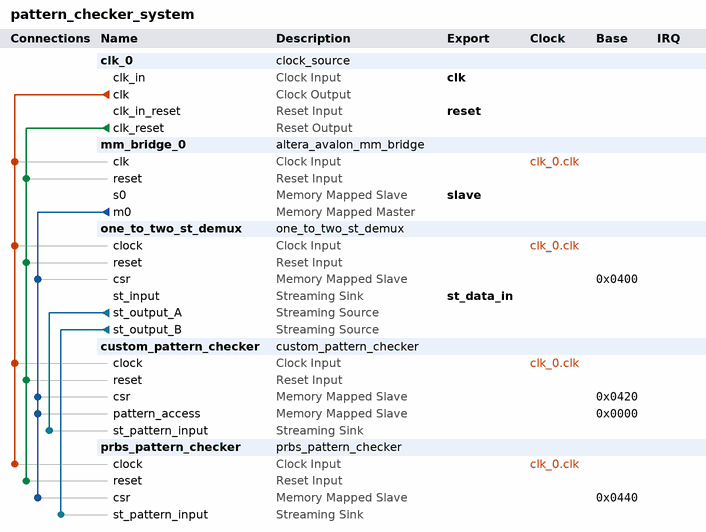
[diagram p0: system contents]
# Platform Designer (Qsys) system pattern_checker_system
# Parameters at their usual value, and those the tool derives, are not listed.
package require -exact qsys 11.0
create_system pattern_checker_system
set_project_property DEVICE_FAMILY CYCLONEIII

add_instance clk_0 clock_source 11.0
set_instance_parameter_value clk_0 clockFrequency 50000000
set_instance_parameter_value clk_0 clockFrequencyKnown false

add_instance mm_bridge_0 altera_avalon_mm_bridge 11.0
set_instance_parameter_value mm_bridge_0 DATA_WIDTH 32
set_instance_parameter_value mm_bridge_0 ADDRESS_WIDTH 11
set_instance_parameter_value mm_bridge_0 ADDRESS_UNITS SYMBOLS
set_instance_parameter_value mm_bridge_0 MAX_PENDING_RESPONSES 4

add_instance one_to_two_st_demux one_to_two_st_demux 1.1
set_instance_parameter_value one_to_two_st_demux DATA_WIDTH 32

add_instance custom_pattern_checker custom_pattern_checker 1.1
set_instance_parameter_value custom_pattern_checker DATA_WIDTH 32
set_instance_parameter_value custom_pattern_checker MAX_PATTERN_LENGTH 256

add_instance prbs_pattern_checker prbs_pattern_checker 1.1
set_instance_parameter_value prbs_pattern_checker DATA_WIDTH 32

# connections
add_connection clk_0.clk custom_pattern_checker.clock clock
add_connection clk_0.clk mm_bridge_0.clk clock
add_connection clk_0.clk one_to_two_st_demux.clock clock
add_connection clk_0.clk prbs_pattern_checker.clock clock
add_connection clk_0.clk_reset custom_pattern_checker.reset reset
add_connection clk_0.clk_reset mm_bridge_0.reset reset
add_connection clk_0.clk_reset one_to_two_st_demux.reset reset
add_connection clk_0.clk_reset prbs_pattern_checker.reset reset
add_connection mm_bridge_0.m0 custom_pattern_checker.csr avalon
set_connection_parameter_value mm_bridge_0.m0/custom_pattern_checker.csr baseAddress 0x0420
add_connection mm_bridge_0.m0 custom_pattern_checker.pattern_access avalon
set_connection_parameter_value mm_bridge_0.m0/custom_pattern_checker.pattern_access baseAddress 0x0000
add_connection mm_bridge_0.m0 one_to_two_st_demux.csr avalon
set_connection_parameter_value mm_bridge_0.m0/one_to_two_st_demux.csr baseAddress 0x0400
add_connection mm_bridge_0.m0 prbs_pattern_checker.csr avalon
set_connection_parameter_value mm_bridge_0.m0/prbs_pattern_checker.csr baseAddress 0x0440
add_connection one_to_two_st_demux.st_output_A custom_pattern_checker.st_pattern_input avalon_streaming
add_connection one_to_two_st_demux.st_output_B prbs_pattern_checker.st_pattern_input avalon_streaming

# exported interfaces
add_interface clk clock sink
set_interface_property clk EXPORT_OF clk_0.clk_in
add_interface reset reset sink
set_interface_property reset EXPORT_OF clk_0.clk_in_reset
add_interface slave avalon slave
set_interface_property slave EXPORT_OF mm_bridge_0.s0
add_interface st_data_in avalon_streaming sink
set_interface_property st_data_in EXPORT_OF one_to_two_st_demux.st_input

save_system pattern_checker_system.qsys
